# Altium schematic sheet CAN_Breakout.SchDoc
size Letter; Organization: Altium Limited; Address1: L3, 12a Rodborough Rd; Address2: Frenchs Forest; Address3: NSW; Address4: Australia 2086
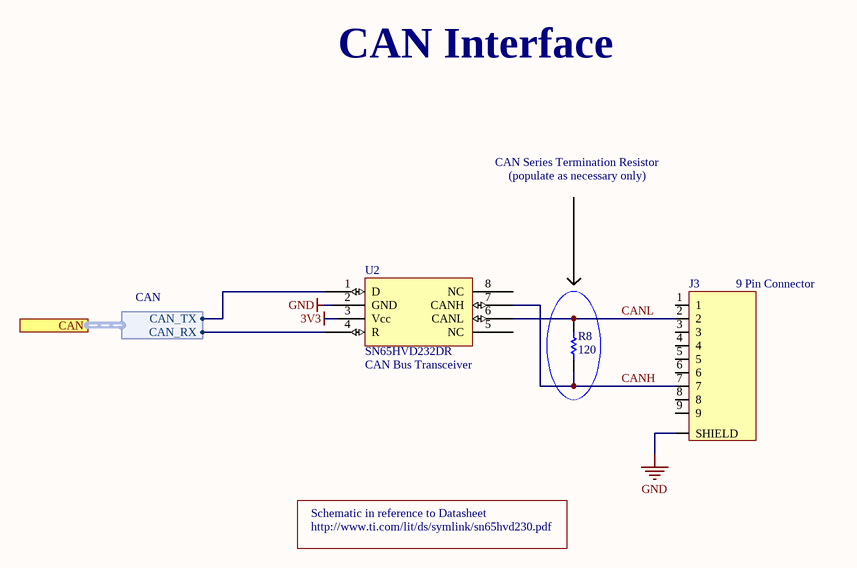
[diagram p0: CAN_Breakout.SchDoc]

## Parts
J3  9 Pin Connector  [9-Pos D-Sub]
R8  value 120  [0402]  (hidden comment: Res1)
U2  CAN Bus Transceiver  [8SOIC-CAN-TRANSCEIVER]

## Ports
CAN (harness CAN)

## Harnesses
CAN: CAN_RX, CAN_TX

## Nets
3V3: U2.3(Vcc)
GND: J3.SHIELD U2.2(GND)
CANH: J3.7 R8.1 U2.7(CANH)
CANL: J3.2 R8.2 U2.6(CANL)
NetU2_1: U2.1(D) ; port CAN.CAN_TX
NetU2_4: U2.4(R) ; port CAN.CAN_RX

Not connected (* = marked no-connect by the designer): J3 1 3 4 5 6 8 9; U2 5(NC) 8(NC)

## Notes on the sheet
- CAN Interface
- CAN Series Termination Resistor
- (populate as necessary only)
- http://www.ti.com/lit/ds/symlink/sn65hvd230.pdf
- Schematic in reference to Datasheet
- Title
- Size:
- Date:
- Letter
- Number:
- Time:
- Revision:
- Sheet
- of
- File:

## Library data of the parts
J3 = 9-Position Connector: Unknown parameter: 772-E09-213R011
R8 = Res1: Resistor
U2 = SN65HVD232DR: Manufacturer: Texas Instruments; Max Data Rate: 1Mbps; Supply Voltage: 3V ~ 3.6V; Manufacturer Part Number: SN65HVD232DR; DigiKey Part Number: 296-26344-1-ND; Operating Temperature: -40 ~ 85 C